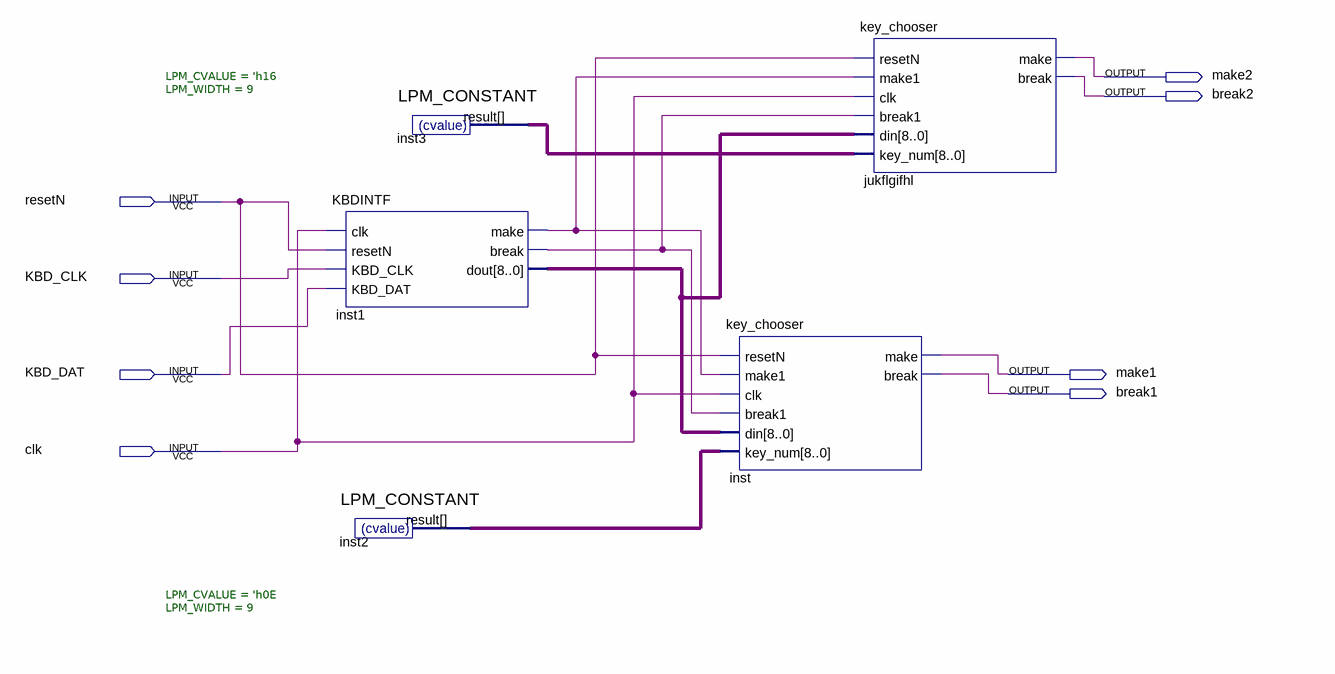
[diagram p0: schematic sheet]
// Quartus schematic keyboard_module_diag.bdf as structural Verilog: 5 symbols, 8 pins
module keyboard_module_diag (
  input  resetN,
  input  KBD_CLK,
  input  KBD_DAT,
  input  clk,
  output make2,
  output break2,
  output make1,
  output break1
);

  wire inst1_break, inst1_make;
  wire [8:0] inst1_dout, inst2_result, inst3_result;

  KBDINTF inst1 (
    .clk(clk), .resetN(resetN), .KBD_CLK(KBD_CLK), .KBD_DAT(KBD_DAT), .make(inst1_make),
    .\break (inst1_break), .dout(inst1_dout));
  LPM_CONSTANT #(.LPM_CVALUE('h0E), .LPM_WIDTH(9)) inst2 (.result(inst2_result));
  LPM_CONSTANT #(.LPM_CVALUE('h16), .LPM_WIDTH(9)) inst3 (.result(inst3_result));
  key_chooser inst (
    .resetN(resetN), .make1(inst1_make), .clk(clk), .break1(inst1_break), .din(inst1_dout),
    .key_num(inst2_result), .make(make1), .\break (break1));
  key_chooser jukflgifhl (
    .resetN(resetN), .make1(inst1_make), .clk(clk), .break1(inst1_break), .din(inst1_dout),
    .key_num(inst3_result), .make(make2), .\break (break2));
endmodule
